# Altium schematic sheet uController.SchDoc
size A3
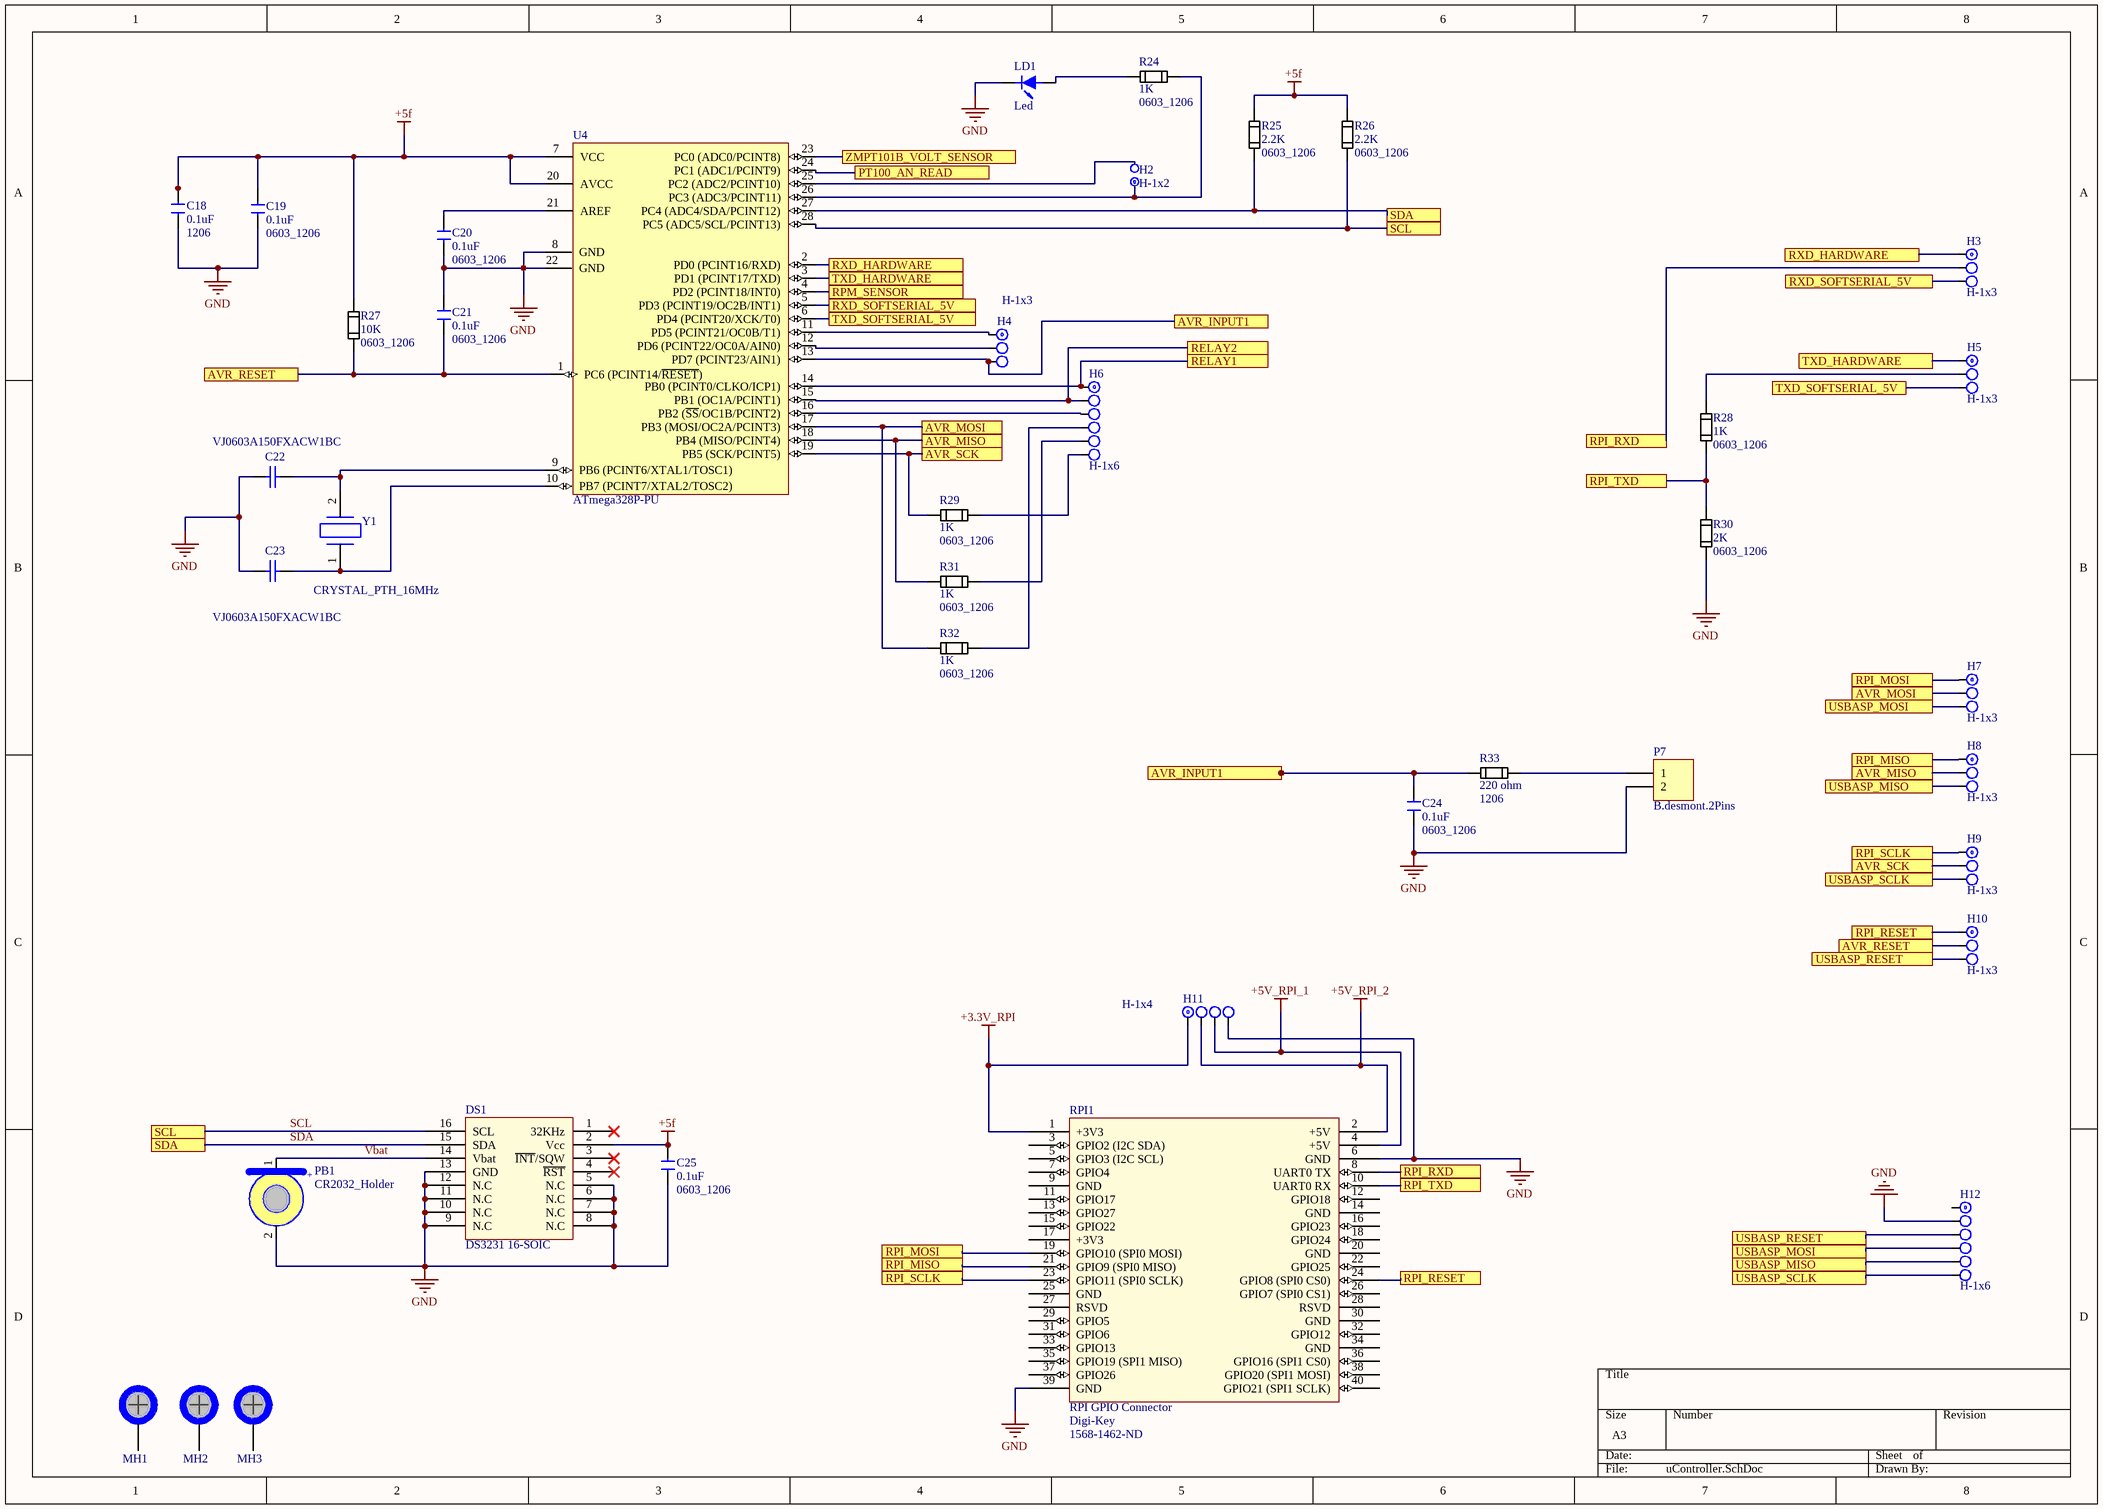
[diagram p0: uController.SchDoc]

## Parts
C18  0.1uF  value 1206  [SMD_CHIP_Cap_Cer_1206]
C19  0.1uF  value 0603_1206  [SMD_CHIP_CAP_CER_0603_TO_1206]
C20  0.1uF  value 0603_1206  [SMD_CHIP_CAP_CER_0603_TO_1206]
C21  0.1uF  value 0603_1206  [SMD_CHIP_CAP_CER_0603_TO_1206]
C22  VJ0603A150FXACW1BC  [CAPC1608X95X40ML15T15]
C23  VJ0603A150FXACW1BC  [CAPC1608X95X40ML15T15]
C24  0.1uF  value 0603_1206  [SMD_CHIP_CAP_CER_0603_TO_1206]
C25  0.1uF  value 0603_1206  [SMD_CHIP_CAP_CER_0603_TO_1206]
DS1  DS3231 16-SOIC  [SOIC127P1030X265-16N]
H2  H-1x2  [J1x2]
H3  H-1x3  [J1x3]
H4  H-1x3  [J1x3]
H5  H-1x3  [J1x3]
H6  H-1x6  [J1x6]
H7  H-1x3  [J1x3]
H8  H-1x3  [J1x3]
H9  H-1x3  [J1x3]
H10  H-1x3  [J1x3]
H11  H-1x4  [J1x4]
H12  H-1x6  [J1x6]
LD1  Led  [Led d5mm]
MH1  MH Pin - 5.5Pad - 3.3drill  [MH Pin - 5.5Pad - 3.3drill]  (value not drawn)
MH2  MH Pin - 5.5Pad - 3.3drill  [MH Pin - 5.5Pad - 3.3drill]  (value not drawn)
MH3  MH Pin - 5.5Pad - 3.3drill  [MH Pin - 5.5Pad - 3.3drill]  (value not drawn)
P7  B.desmont.2Pins  [KF2EDGV/R-2P]
PB1  CR2032_Holder  [CR2032]
R24  1K  value 0603_1206  [SMD_CHIP_RESISTOR_0603_TO_1206]
R25  2.2K  value 0603_1206  [SMD_CHIP_RESISTOR_0603_TO_1206]
R26  2.2K  value 0603_1206  [SMD_CHIP_RESISTOR_0603_TO_1206]
R27  10K  value 0603_1206  [SMD_CHIP_RESISTOR_0603_TO_1206]
R28  1K  value 0603_1206  [SMD_CHIP_RESISTOR_0603_TO_1206]
R29  1K  value 0603_1206  [SMD_CHIP_RESISTOR_0603_TO_1206]
R30  2K  value 0603_1206  [SMD_CHIP_RESISTOR_0603_TO_1206]
R31  1K  value 0603_1206  [SMD_CHIP_RESISTOR_0603_TO_1206]
R32  1K  value 0603_1206  [SMD_CHIP_RESISTOR_0603_TO_1206]
R33  220 ohm  value 1206  [SMD_CHIP_RESISTOR_1206]
RPI1  RPI GPIO Connector  Supplier 1: Digi-Key  Supplier Part Number 1: 1568-1462-ND  [rpi]
U4  ATmega328P-PU  [28P3]
Y1  CRYSTAL_PTH_16MHz  [Crystal PTH HC49LT, THT, 16MHz]

## Ports
AVR_INPUT1, AVR_MISO, AVR_MOSI, AVR_RESET, AVR_SCK, PT100_AN_READ, RELAY1, RELAY2, RPI_MISO, RPI_MOSI, RPI_RESET, RPI_RXD, RPI_SCLK, RPI_TXD, RPM_SENSOR, RXD_HARDWARE, RXD_SOFTSERIAL_5V, SCL, SDA, TXD_HARDWARE, TXD_SOFTSERIAL_5V, USBASP_MISO, USBASP_MOSI, USBASP_RESET, USBASP_SCLK, ZMPT101B_VOLT_SENSOR

## Nets
+3.3V_RPI: H11.1 RPI1.1(+3V3)
+5f: C18.2 C19.1 C25.2 DS1.2(Vcc) R25.2 R26.2 R27.2 U4.7(VCC) U4.20(AVCC)
+5V_RPI_1: H11.3 RPI1.4(+5V)
+5V_RPI_2: H11.2 RPI1.2(+5V)
GND: C18.1 C19.2 C20.2 C21.1 C22.1 C23.1 C24.1 C25.1 DS1.5(N.C) DS1.6(N.C) DS1.7(N.C) DS1.8(N.C) DS1.9(N.C) DS1.10(N.C) DS1.11(N.C) DS1.12(N.C) DS1.13(GND) H11.4 H12.2 LD1.2(K) P7.2 PB1.2 R30.1 RPI1.6(GND) RPI1.39(GND) U4.8(GND) U4.22(GND)
AVR_INPUT1: C24.2 H4.3 R33.1 U4.13(PD7_(PCINT23/AIN1)) ; port AVR_INPUT1
AVR_MISO: H8.2 R31.2 U4.18(PB4_(MISO/PCINT4)) ; port AVR_MISO
AVR_MOSI: H7.2 R32.2 U4.17(PB3_(MOSI/OC2A/PCINT3)) ; port AVR_MOSI
AVR_RESET: C21.2 H10.2 R27.1 U4.1(PC6_(PCINT14/~{RESET})) ; port AVR_RESET
AVR_SCK: H9.2 R29.2 U4.19(PB5_(SCK/PCINT5)) ; port AVR_SCK
PT100_AN_READ: U4.24(PC1_(ADC1/PCINT9)) ; port PT100_AN_READ
RELAY1: H6.1 U4.14(PB0_(PCINT0/CLKO/ICP1)) ; port RELAY1
RELAY2: H6.2 U4.15(PB1_(OC1A/PCINT1)) ; port RELAY2
RPI_MISO: H8.1 RPI1.21(GPIO9_(SPI0_MISO)) ; port RPI_MISO
RPI_MOSI: H7.1 RPI1.19(GPIO10_(SPI0_MOSI)) ; port RPI_MOSI
RPI_RESET: H10.1 RPI1.24(GPIO8_(SPI0_CS0)) ; port RPI_RESET
RPI_RXD: H3.2 RPI1.8(UART0_TX) ; port RPI_RXD
RPI_SCLK: H9.1 RPI1.23(GPIO11_(SPI0_SCLK)) ; port RPI_SCLK
RPI_TXD: R28.1 R30.2 RPI1.10(UART0_RX) ; port RPI_TXD
RPM_SENSOR: U4.4(PD2_(PCINT18/INT0)) ; port RPM_SENSOR
RXD_HARDWARE: H3.1 U4.2(PD0_(PCINT16/RXD)) ; port RXD_HARDWARE
RXD_SOFTSERIAL_5V: H3.3 U4.5(PD3_(PCINT19/OC2B/INT1)) ; port RXD_SOFTSERIAL_5V
SCL: DS1.16(SCL) R26.1 U4.28(PC5_(ADC5/SCL/PCINT13)) ; port SCL
SDA: DS1.15(SDA) R25.1 U4.27(PC4_(ADC4/SDA/PCINT12)) ; port SDA
TXD_HARDWARE: H5.1 U4.3(PD1_(PCINT17/TXD)) ; port TXD_HARDWARE
TXD_SOFTSERIAL_5V: H5.3 U4.6(PD4_(PCINT20/XCK/T0)) ; port TXD_SOFTSERIAL_5V
USBASP_MISO: H8.3 H12.5 ; port USBASP_MISO
USBASP_MOSI: H7.3 H12.4 ; port USBASP_MOSI
USBASP_RESET: H10.3 H12.3 ; port USBASP_RESET
USBASP_SCLK: H9.3 H12.6 ; port USBASP_SCLK
Vbat: DS1.14(Vbat) PB1.1
ZMPT101B_VOLT_SENSOR: U4.23(PC0_(ADC0/PCINT8)) ; port ZMPT101B_VOLT_SENSOR
NetC20_1: C20.1 U4.21(AREF)
NetC22_2: C22.2 U4.9(PB6_(PCINT6/XTAL1/TOSC1)) Y1.2
NetC23_2: C23.2 U4.10(PB7_(PCINT7/XTAL2/TOSC2)) Y1.1
NetH2_1: H2.1 R24.1 U4.26(PC3_(ADC3/PCINT11))
NetH2_2: H2.2 U4.25(PC2_(ADC2/PCINT10))
NetH4_1: H4.1 U4.11(PD5_(PCINT21/OC0B/T1))
NetH4_2: H4.2 U4.12(PD6_(PCINT22/OC0A/AIN0))
NetH5_2: H5.2 R28.2
NetH6_3: H6.3 U4.16(PB2_(~{SS}/OC1B/PCINT2))
NetH6_4: H6.4 R32.1
NetH6_5: H6.5 R31.1
NetH6_6: H6.6 R29.1
NetLD1_1: LD1.1(A) R24.2
NetP7_1: P7.1 R33.2

Not connected (* = marked no-connect by the designer): DS1 1(32KHz)* 3(~{INT}/SQW)* 4(~{RST})*; H12 1; MH1 1(Grounding); MH2 1(Grounding); MH3 1(Grounding); RPI1 3(GPIO2_(I2C_SDA)) 5(GPIO3_(I2C_SCL)) 7(GPIO4) 9(GND) 11(GPIO17) 12(GPIO18) 13(GPIO27) 14(GND) 15(GPIO22) 16(GPIO23) 17(+3V3) 18(GPIO24) 20(GND) 22(GPIO25) 25(GND) 26(GPIO7_(SPI0_CS1)) 27(RSVD) 28(RSVD) 29(GPIO5) 30(GND) 31(GPIO6) 32(GPIO12) 33(GPIO13) 34(GND) 35(GPIO19_(SPI1_MISO)) 36(GPIO16_(SPI1_CS0)) 37(GPIO26) 38(GPIO20_(SPI1_MOSI)) 40(GPIO21_(SPI1_SCLK))

## Notes on the sheet
- (in symbol CR2032_Holder) +

## Library data of the parts
C18 = SMD_CHIP_CAP_CER_1206
C19-C21 C24 C25 = SMD_CHIP_CAP_CER_0603_TO_1206
C22 C23 = CMP-2006-01814-1: Manufacturer: Vitramon; Part Number: VJ0603A150FXACW1BC
DS1 = DS3231: SOIC, 16-Leads, Body 10.5x7.5mm (max), Pitch 1.27mm, IPC Medium Density
LD1 = Led-5mm: 5mm; Price: 0.05
P7 = Header 2: Header, 2-Pin; LatestRevisionDate: 17-Jul-2002; LatestRevisionNote: Re-released for DXP Platform.; Publisher: Altium Limited
R24-R32 = SMD_CHIP_RESISTOR_0603_TO_1206
R33 = SMD_CHIP_RESISTOR_1206
RPI1 = rpi connector: GPIO Header for Raspberry Pi A+/B+/Pi 2/Pi 3 - 2x20; Manufacturer: SparkFun Electronics; Manufacturer Part Number: PRT-14017; Nils Minor: author; nilsminor@web.de: mail; RoHS: RoHS Compliant; Category: Development Boards, Kits, Programmers; Stock 1: 150; Pricing 1: 1=1.84 (EUR); Part Status: Active; Accessory Type: Connector; For Use With/Related Products: Raspberry Pi; ComponentLink1URL: https://cdn.sparkfun.com/datasheets/Dev/RaspberryPi/12313.pdf; ComponentLink1Description: https://cdn.sparkfun.com/datasheets/Dev/RaspberryPi/12313.pdf
U4 = CMP-0095-00013-2: 8-bit AVR Microcontroller, 32KB Flash, 1KB EEPROM, 2KB SRAM, 28-pin PDIP, Industrial Grade (-40°C to 85°C); RevisionNote: DatasheetVersion updated. URLs added.; PackageVersion: revB, Sep-2001; PackageDescription: 28-lead (0.300"/7.62mm Wide) Plastic Dual Inline Package (PDIP); DatasheetVersion: revD, May-2011; ComponentLink1Description: Manufacturer URL; ComponentLink1URL: http://www.atmel.com/; PackageReference: 28P3; ComponentLink2Description: ATmega48A/48PA/88A/88PA/168A/168PA/328/328P Datasheet; ComponentLink3URL: http://www.atmel.com/dyn/resources/prod_documents/8271S.pdf; ComponentLink2URL: http://www.atmel.com/dyn/resources/prod_documents/8271.pdf; ComponentLink3Description: ATmega48A/48PA/88A/88PA/168A/168PA/328/328P Summary
H2 = H-1x2: Price: 0.02
H3-H5 H7-H10 = H-1x3: Price: 0.03
H6 H12 = H-1x6: Price: 0.06
H11 = H-1x4: Price: 0.04